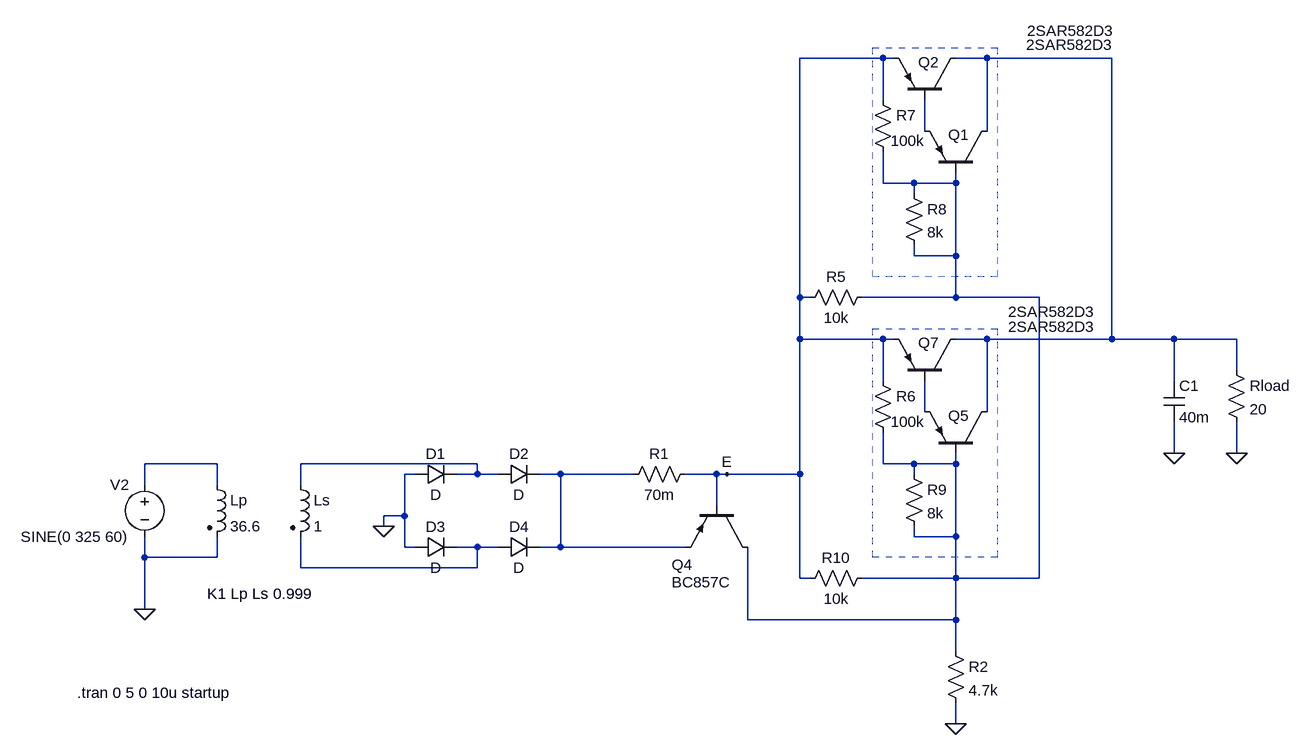
[diagram p0: schematic supply.asc]
supply.asc, the LTspice schematic file:
Version 4
SHEET 1 2052 1268
WIRE 720 -400 592 -400
WIRE 736 -400 720 -400
WIRE 880 -400 832 -400
WIRE 1072 -400 880 -400
WIRE 720 -336 720 -400
WIRE 784 -288 784 -336
WIRE 880 -288 880 -400
WIRE 720 -208 720 -256
WIRE 768 -208 720 -208
WIRE 832 -208 832 -224
WIRE 832 -208 768 -208
WIRE 768 -192 768 -208
WIRE 768 -96 768 -112
WIRE 832 -96 832 -208
WIRE 832 -96 768 -96
WIRE 592 -32 592 -400
WIRE 608 -32 592 -32
WIRE 832 -32 832 -96
WIRE 832 -32 688 -32
WIRE 960 -32 832 -32
WIRE 592 32 592 -32
WIRE 720 32 592 32
WIRE 736 32 720 32
WIRE 880 32 832 32
WIRE 1072 32 1072 -400
WIRE 1072 32 880 32
WIRE 1168 32 1072 32
WIRE 1264 32 1168 32
WIRE 1264 80 1264 32
WIRE 720 96 720 32
WIRE 1168 96 1168 32
WIRE 784 144 784 96
WIRE 880 144 880 32
WIRE 1168 208 1168 160
WIRE 1264 208 1264 160
WIRE -304 224 -416 224
WIRE 96 224 -176 224
WIRE 720 224 720 176
WIRE 768 224 720 224
WIRE 832 224 832 208
WIRE 832 224 768 224
WIRE 0 240 -16 240
WIRE 96 240 96 224
WIRE 96 240 64 240
WIRE 128 240 96 240
WIRE 224 240 192 240
WIRE 336 240 224 240
WIRE 464 240 416 240
WIRE 480 240 464 240
WIRE 592 240 592 32
WIRE 592 240 480 240
WIRE 768 240 768 224
WIRE -416 256 -416 224
WIRE -304 256 -304 224
WIRE -176 256 -176 224
WIRE 464 288 464 240
WIRE -16 304 -16 240
WIRE -16 304 -48 304
WIRE -48 320 -48 304
WIRE 768 336 768 320
WIRE 832 336 832 224
WIRE 832 336 768 336
WIRE -16 352 -16 304
WIRE 0 352 -16 352
WIRE 96 352 64 352
WIRE 128 352 96 352
WIRE 224 352 224 240
WIRE 224 352 192 352
WIRE 416 352 224 352
WIRE -416 368 -416 336
WIRE -304 368 -304 336
WIRE -304 368 -416 368
WIRE -176 384 -176 336
WIRE 96 384 96 352
WIRE 96 384 -176 384
WIRE 592 400 592 240
WIRE 608 400 592 400
WIRE 832 400 832 336
WIRE 832 400 688 400
WIRE 960 400 960 -32
WIRE 960 400 832 400
WIRE -416 448 -416 368
WIRE 512 464 512 352
WIRE 832 464 832 400
WIRE 832 464 512 464
WIRE 832 512 832 464
WIRE 832 624 832 592
FLAG 1264 208 0
FLAG 1168 208 0
FLAG -48 320 0
FLAG -416 448 0
FLAG 832 624 0
FLAG 480 240 E
SYMBOL res 1248 64 R0
SYMATTR InstName Rload
SYMATTR Value 20
SYMBOL cap 1152 96 R0
SYMATTR InstName C1
SYMATTR Value 40m
SYMATTR SpiceLine Rser=50m
SYMBOL voltage -416 240 M0
SYMATTR InstName V2
SYMATTR Value SINE(0 325 60)
SYMBOL ind2 -320 240 R0
SYMATTR InstName Lp
SYMATTR Value 36.6
SYMATTR Type ind
SYMATTR SpiceLine Rser=20
SYMBOL ind2 -192 240 R0
SYMATTR InstName Ls
SYMATTR Value 1
SYMATTR Type ind
SYMATTR SpiceLine Rser=1
SYMBOL diode 0 256 R270
WINDOW 0 32 32 VTop 2
WINDOW 3 0 32 VBottom 2
SYMATTR InstName D1
SYMBOL diode 128 256 R270
WINDOW 0 32 32 VTop 2
WINDOW 3 0 32 VBottom 2
SYMATTR InstName D2
SYMBOL diode 0 368 R270
WINDOW 0 32 32 VTop 2
WINDOW 3 0 32 VBottom 2
SYMATTR InstName D3
SYMBOL diode 128 368 R270
WINDOW 0 32 32 VTop 2
WINDOW 3 0 32 VBottom 2
SYMATTR InstName D4
SYMBOL res 432 224 R90
WINDOW 0 0 56 VBottom 2
WINDOW 3 32 56 VTop 2
SYMATTR InstName R1
SYMATTR Value 70m
SYMBOL res 816 496 R0
SYMATTR InstName R2
SYMATTR Value 4.7k
SYMBOL pnp 512 288 R90
WINDOW 0 91 85 VRight 2
WINDOW 3 118 26 VRight 2
SYMATTR InstName Q4
SYMATTR Value BC857C
SYMBOL res 704 -48 R90
WINDOW 0 0 56 VBottom 2
WINDOW 3 32 56 VTop 2
SYMATTR InstName R5
SYMATTR Value 10k
SYMBOL pnp 880 -224 M270
WINDOW 0 58 60 VLeft 2
WINDOW 3 197 -60 VLeft 2
SYMATTR InstName Q1
SYMATTR Value 2SAR582D3
SYMBOL pnp 832 -336 M270
WINDOW 0 58 58 VLeft 2
WINDOW 3 106 -110 VLeft 2
SYMATTR InstName Q2
SYMATTR Value 2SAR582D3
SYMBOL res 704 -352 R0
WINDOW 3 28 79 Left 2
SYMATTR InstName R7
SYMATTR Value 100k
SYMBOL res 752 -208 R0
SYMATTR InstName R8
SYMATTR Value 8k
SYMBOL pnp 880 208 M270
WINDOW 0 58 60 VLeft 2
WINDOW 3 195 -33 VLeft 2
SYMATTR InstName Q5
SYMATTR Value 2SAR582D3
SYMBOL pnp 832 96 M270
WINDOW 0 58 58 VLeft 2
WINDOW 3 106 -81 VLeft 2
SYMATTR InstName Q7
SYMATTR Value 2SAR582D3
SYMBOL res 704 80 R0
WINDOW 3 28 79 Left 2
SYMATTR InstName R6
SYMATTR Value 100k
SYMBOL res 752 224 R0
SYMATTR InstName R9
SYMATTR Value 8k
SYMBOL res 704 384 R90
WINDOW 0 0 56 VBottom 2
WINDOW 3 32 56 VTop 2
SYMATTR InstName R10
SYMATTR Value 10k
TEXT -520 576 Left 2 !.tran 0 5 0 10u startup
TEXT -320 424 Left 2 !K1 Lp Ls 0.999
RECTANGLE Normal 896 -64 704 -416 2
RECTANGLE Normal 896 368 704 16 2

The netlist it stands for:
* supply.asc
Rload N001 0 20
C1 N001 0 40m Rser=50m
V2 N005 0 SINE(0 325 60)
Lp N005 0 36.6 Rser=20
Ls N006 N008 1 Rser=1
D1 0 N006 D
D2 N006 N007 D
D3 0 N008 D
D4 N008 N007 D
R1 E N007 70m
R2 N003 0 4.7k
Q4 N003 E N007 0 BC857C
R5 N003 E 10k
Q1 N001 N003 N002 0 2SAR582D3
Q2 N001 N002 E 0 2SAR582D3
R7 E N003 100k
R8 N003 N003 8k
Q5 N001 N003 N004 0 2SAR582D3
Q7 N001 N004 E 0 2SAR582D3
R6 E N003 100k
R9 N003 N003 8k
R10 N003 E 10k
.model D D
.lib standard.dio
.model NPN NPN
.model PNP PNP
.lib standard.bjt
.tran 0 5 0 10u startup
K1 Lp Ls 0.999
.backanno
.end